# Altium schematic sheet output_headers.SchDoc
size A4
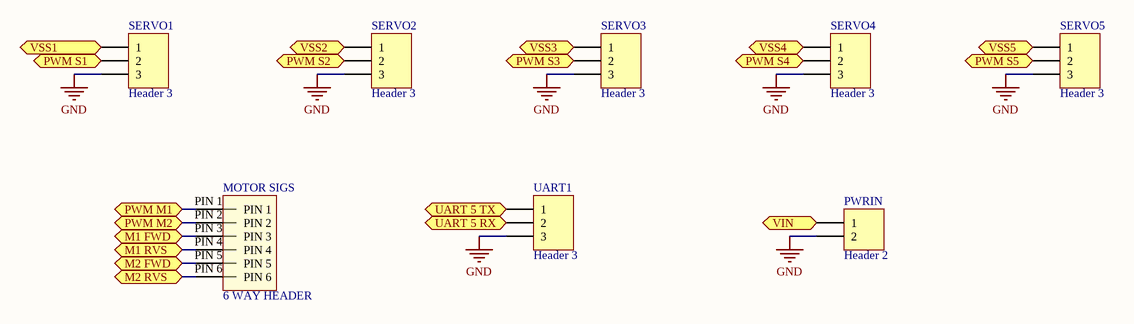
[diagram p0: output_headers.SchDoc]

## Parts
MOTOR_SIGS  6 WAY HEADER  [PH CONNECTOR 6 WAY]
PWRIN  Header 2  [HDR1X2]
SERVO1  Header 3  [HDR1X3]
SERVO2  Header 3  [HDR1X3]
SERVO3  Header 3  [HDR1X3]
SERVO4  Header 3  [HDR1X3]
SERVO5  Header 3  [HDR1X3]
UART1  Header 3  [HDR1X3]

## Ports
M1 FWD, M1 RVS, M2 FWD, M2 RVS, PWM M1, PWM M2, PWM S1, PWM S2, PWM S3, PWM S4, PWM S5, UART 5 RX, UART 5 TX, VIN, VSS1, VSS2, VSS3, VSS4, VSS5

## Nets
GND: PWRIN.2 SERVO1.3 SERVO2.3 SERVO3.3 SERVO4.3 SERVO5.3 UART1.3
M1 FWD: MOTOR_SIGS.PIN_3 ; port M1 FWD
M1 RVS: MOTOR_SIGS.PIN_4 ; port M1 RVS
M2 FWD: MOTOR_SIGS.PIN_5 ; port M2 FWD
M2 RVS: MOTOR_SIGS.PIN_6 ; port M2 RVS
PWM M1: MOTOR_SIGS.PIN_1 ; port PWM M1
PWM M2: MOTOR_SIGS.PIN_2 ; port PWM M2
PWM S1: SERVO1.2 ; port PWM S1
PWM S2: SERVO2.2 ; port PWM S2
PWM S3: SERVO3.2 ; port PWM S3
PWM S4: SERVO4.2 ; port PWM S4
PWM S5: SERVO5.2 ; port PWM S5
UART 5 RX: UART1.2 ; port UART 5 RX
UART 5 TX: UART1.1 ; port UART 5 TX
VIN: PWRIN.1 ; port VIN
VSS1: SERVO1.1 ; port VSS1
VSS2: SERVO2.1 ; port VSS2
VSS3: SERVO3.1 ; port VSS3
VSS4: SERVO4.1 ; port VSS4
VSS5: SERVO5.1 ; port VSS5

## Library data of the parts
MOTOR_SIGS = PH HEADER 6 WAY
PWRIN = Header 2: Header, 2-Pin; LatestRevisionDate: 17-Jul-2002; LatestRevisionNote: Re-released for DXP Platform.; Publisher: Altium Limited
SERVO1-SERVO5 UART1 = Header 3: Header, 3-Pin; LatestRevisionDate: 17-Jul-2002; LatestRevisionNote: Re-released for DXP Platform.; Publisher: Altium Limited